# EAGLE schematic Hot_Plate (EAGLE 5.11)
DIGIKEY_LINK: http://parts.digikey.com/1/parts/991324-triac-600v-4a-to220ab-bt136-600d-127.html

## Sheet 1 of 6
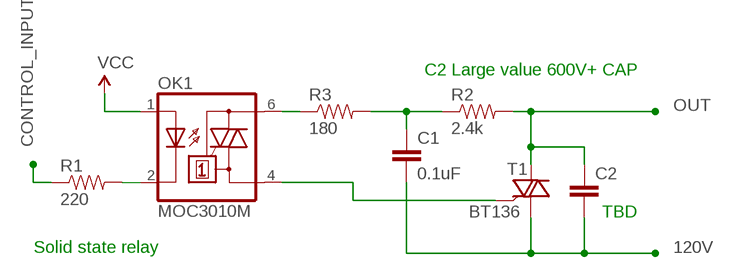
[diagram p0: schematic, sheet 1]

### Parts
C1  0.1uF  CAPPTH1  [CAP-PTH-5MM]
C2  CAPPTH1  [CAP-PTH-5MM]
OK1  MOC3010M  [DIL06]
R1  220  SPARKFUN_RESISTOR  [SPARKFUN_0805]
R2  2.4k  RESISTORPTH-1/2W  [AXIAL-0.5]
R3  180  RESISTORPTH-1/4W  [AXIAL-0.4]
T1  BT136  [TO220AB]

### Nets
120V [ac_power]: C1.2 C2.2 T1.1(A1)
CONTROL_INPUT: R1.1 ; also sheet 3
N$1: OK1.2(C) R1.2
N$3: OK1.6(A2) R3.P$1
N$4: C1.1 R2.P$1 R3.P$2
N$5: OK1.4(A1) T1.3(G)
OUT [ac_power]: C2.1 R2.P$2 T1.2(A2)
VCC [power]: OK1.1(A) ; also sheet 2,3,4,5,6

### Notes on the sheet
- C2 Large value 600V+ CAP
- TBD
- Solid state relay

## Sheet 2 of 6
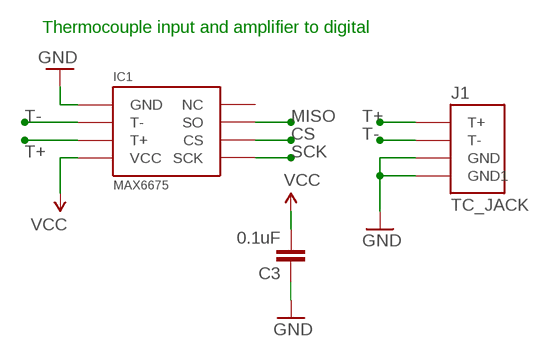
[diagram p1: schematic, sheet 2]

### Parts
C3  0.1uF  CAP0805  [0805]
IC1  MAX6675  [SOIC-8]
J1  TC_JACK  [TC_JACK]

### Nets
CS: IC1.CS ; also sheet 3
GND [power]: C3.1 IC1.GND J1.P$1(GND) J1.P$2(GND1) ; also sheet 3,4,5,6
MISO: IC1.SO ; also sheet 3
SCK: IC1.SCK ; also sheet 3
T+: IC1.T+ J1.T+
T-: IC1.T- J1.T-
VCC [power]: C3.2 IC1.VCC ; also sheet 1,3,4,5,6
Unconnected: IC1.NC

### Notes on the sheet
- Thermocouple input and amplifier to digital

## Sheet 3 of 6
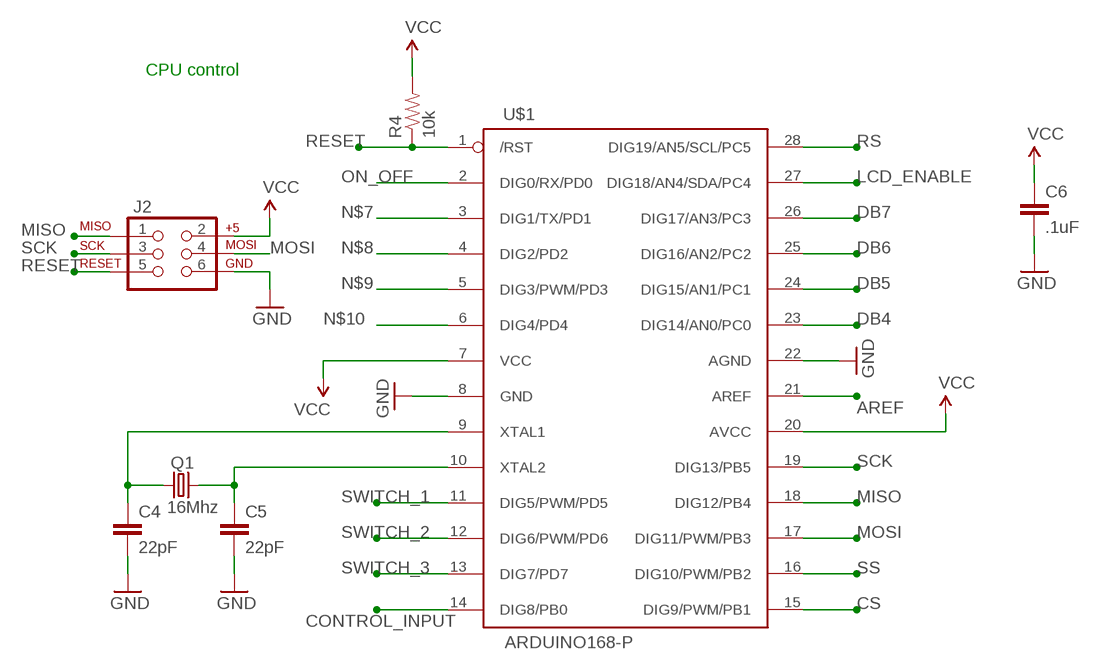
[diagram p2: schematic, sheet 3]

### Parts
C4  22pF  C-EUC0805  [C0805]
C5  22pF  C-EUC0805  [C0805]
C6  .1uF  CAP0805  [0805]
J2  AVR_SPI_PRG_6PTH  [2X3]
Q1  16Mhz  CRYSTALHC49S  [HC49/S]
R4  10k  RESISTOR  [0805]
U$1  ARDUINO168-P  [DIL28-3]

### Nets
AREF: U$1.21(AREF)
CONTROL_INPUT: U$1.14(DIG8/PB0) ; also sheet 1
CS: U$1.15(DIG9/PWM/PB1) ; also sheet 2
DB4: U$1.23(DIG14/AN0/PC0) ; also sheet 4
DB5: U$1.24(DIG15/AN1/PC1) ; also sheet 4
DB6: U$1.25(DIG16/AN2/PC2) ; also sheet 4
DB7: U$1.26(DIG17/AN3/PC3) ; also sheet 4
GND [power]: C4.2 C5.2 C6.2 J2.6 U$1.8(GND) U$1.22(AGND) ; also sheet 2,4,5,6
LCD_ENABLE: U$1.27(DIG18/AN4/SDA/PC4) ; also sheet 4
MISO: J2.1 U$1.18(DIG12/PB4) ; also sheet 2
MOSI: J2.4 U$1.17(DIG11/PWM/PB3)
N$7: U$1.3(DIG1/TX/PD1)
N$8: U$1.4(DIG2/PD2)
N$9: U$1.5(DIG3/PWM/PD3)
N$10: U$1.6(DIG4/PD4)
ON_OFF: U$1.2(DIG0/RX/PD0) ; also sheet 5
RESET: J2.5 R4.1 U$1.1(/RST)
RS: U$1.28(DIG19/AN5/SCL/PC5) ; also sheet 4
SCK: J2.3 U$1.19(DIG13/PB5) ; also sheet 2
SS: U$1.16(DIG10/PWM/PB2)
SWITCH_1: U$1.11(DIG5/PWM/PD5) ; also sheet 5
SWITCH_2: U$1.12(DIG6/PWM/PD6) ; also sheet 5
SWITCH_3: U$1.13(DIG7/PD7) ; also sheet 5
VCC [power]: C6.1 J2.2 R4.2 U$1.7(VCC) U$1.20(AVCC) ; also sheet 1,2,4,5,6
XTAL1: C4.1 Q1.1 U$1.9(XTAL1)
XTAL2: C5.1 Q1.2 U$1.10(XTAL2)

### Notes on the sheet
- CPU control

## Sheet 4 of 6
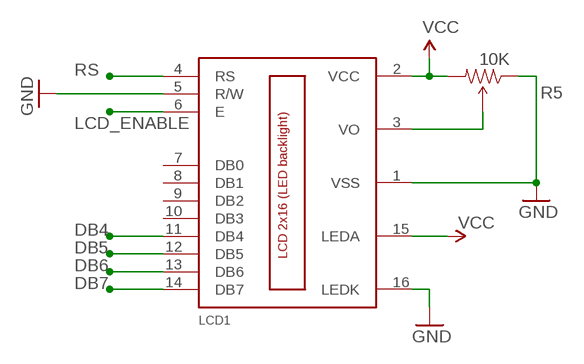
[diagram p3: schematic, sheet 4]

### Parts
LCD1  LCD_2X16  [HY-1602F]
R5  10K  TRIMPOT  [3362U-2]

### Nets
DB4: LCD1.11(DB4) ; also sheet 3
DB5: LCD1.12(DB5) ; also sheet 3
DB6: LCD1.13(DB6) ; also sheet 3
DB7: LCD1.14(DB7) ; also sheet 3
GND [power]: LCD1.1(VSS) LCD1.5(R/W) LCD1.16(LEDK) R5.1(CCW) ; also sheet 2,3,5,6
LCD_ENABLE: LCD1.6(E) ; also sheet 3
N$6: LCD1.3(VO) R5.2(WIPER)
RS: LCD1.4(RS) ; also sheet 3
VCC [power]: LCD1.2(VCC) LCD1.15(LEDA) R5.3(CW) ; also sheet 1,2,3,5,6
Unconnected: LCD1.7(DB0) LCD1.8(DB1) LCD1.9(DB2) LCD1.10(DB3)

## Sheet 5 of 6
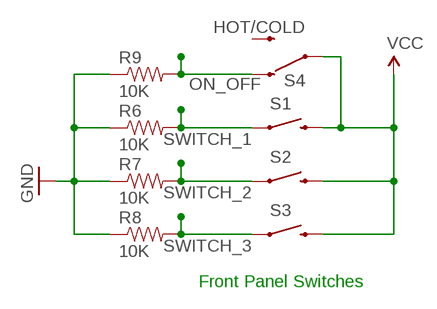
[diagram p4: schematic, sheet 5]

### Parts
R6  10K  RESISTOR  [0805]
R7  10K  RESISTOR  [0805]
R8  10K  RESISTOR  [0805]
R9  10K  RESISTOR  [0805]
S1  SWITCH-MOMENTARY-2PTH  [TACTILE-PTH]
S2  SWITCH-MOMENTARY-2PTH  [TACTILE-PTH]
S3  SWITCH-MOMENTARY-2PTH  [TACTILE-PTH]
S4  HOT/COLD  SWITCH_SPDT  [SWITCH_OS102011MS2QN1]

### Nets
GND [power]: R6.1 R7.1 R8.1 R9.1 ; also sheet 2,3,4,6
ON_OFF: R9.2 S4.P$3 ; also sheet 3
SWITCH_1: R6.2 S1.1 ; also sheet 3
SWITCH_2: R7.2 S2.1 ; also sheet 3
SWITCH_3: R8.2 S3.1 ; also sheet 3
VCC [power]: S1.3 S2.3 S3.3 S4.P$2 ; also sheet 1,2,3,4,6
Unconnected: S4.P$1

### Notes on the sheet
- Front Panel Switches

## Sheet 6 of 6
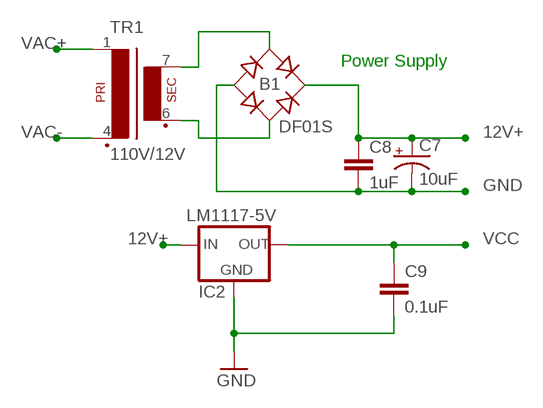
[diagram p5: schematic, sheet 6]

### Parts
B1  DF01S  [DFS]
C7  10uF  CAP_POLPTH2  [CPOL-RADIAL-10UF-25V]
C8  1uF  CAPPTH  [CAP-PTH-SMALL]
C9  0.1uF  CAPPTH  [CAP-PTH-SMALL]
IC2  LM1117-5V  LM1117  [SOT223]
TR1  110V/12V  EE20-1  [EE20-1]

### Nets
12V+: B1.+ C7.1(+) C8.1 IC2.3(IN)
GND [power]: B1.- C7.2(-) C8.2 C9.2 IC2.1(GND) ; also sheet 2,3,4,5
N$12: B1.AC2 TR1.6(S3)
N$13: B1.AC1 TR1.7(S4)
VAC+ [ac_power]: TR1.1
VAC- [ac_power]: TR1.4(P2)
VCC [power]: C9.1 IC2.2(OUT) ; also sheet 1,2,3,4,5

### Notes on the sheet
- Power Supply

## Library data of the parts
B1 = rectifier:DF*S: Surface Mount Glass Passivated Bridge Rectifiers Source: Source: Comchip Bridge Rectifiers DF005S-G thru DF10S-G.pdf
C1-C3 C6 C8 C9 = SparkFun:CAP: Capacitor Standard 0603 ceramic capacitor, and 0.1" leaded capacitor.
C4 C5 = rcl:C-EU: CAPACITOR, European symbol
C7 = SparkFun:CAP_POL: Capacitor Polarized These are standard SMD and PTH capacitors. Normally 10uF, 47uF, and 100uF in electrolytic and tantalum varieties. Always verify the external diameter of the through hole cap, it varies with capacity, voltage, and manufacturer. The EIA devices should be standard.
IC1 = Thermocouple:MAX6675: MAX6675 Thermocouple to Digital Converter
IC2 = v-reg-3:LM1117
J1 = Thermocouple:TC_JACK: PCB Thermocouple Connector
J2 = SparkFun:AVR_SPI_PRG_6: AVR ISP 6 Pin This is the reduced ISP connector for AVR programming. Common on Arduino. This footprint will take up less PCB space and can be used with a 10-pin to 6-pin adapter such as SKU: BOB-08508
LCD1 = lcd_2x16_led_backlight:LCD_2X16
OK1 = optocoupler:MOC30*M: RANDOM-PHASE OPTOISOLATORS TRIAC DRIVER OUTPUT Source: http://www.fairchildsemi.com MOC3020-M.pdf; MF: FAIRCHILD SEMICONDUCTOR; MPN: MOC3010-M; OC_FARNELL: 1505423; OC_NEWARK: 72K8892
Q1 = crystal:CRYSTAL: CRYSTAL; OC_FARNELL: 1667008; OC_NEWARK: unknown
R1 = Nullspace:SPARKFUN_RESISTOR: Resistor Basic schematic elements and footprints for 0603, 1206, and PTH 1/10th watt (small) resistors.
R2 R3 = SparkFun:RESISTOR: Resistor
R4 R6-R9 = tvbgone-adj:RESISTOR: Resistor
R5 = SparkFun:TRIMPOT
S1-S3 = SparkFun:SWITCH-MOMENTARY-2
S4 = Nullspace:SWITCH_SPDT
T1 = triac:BT136: Triac BT136 series E sensitive gate Source: http://www.nxp.com/acrobat_download/datasheets/BT136_SERIES_E_2.pdf
TR1 = trafo:EE20-1: TRANSFORMER 1 primary winding, 1 secondary winding ERA
U$1 = AI-1_parts:ARDUINO168-P: Arduino ATmega168 16 k Flash 1 k RAM 512 bytes EEPROM 6 ADC 6 PWM

## Net classes
1 ac_power: width 0.762 mm
2 power: width 0.305 mm